# Altium project RP2040_Evaluation.PrjPcb
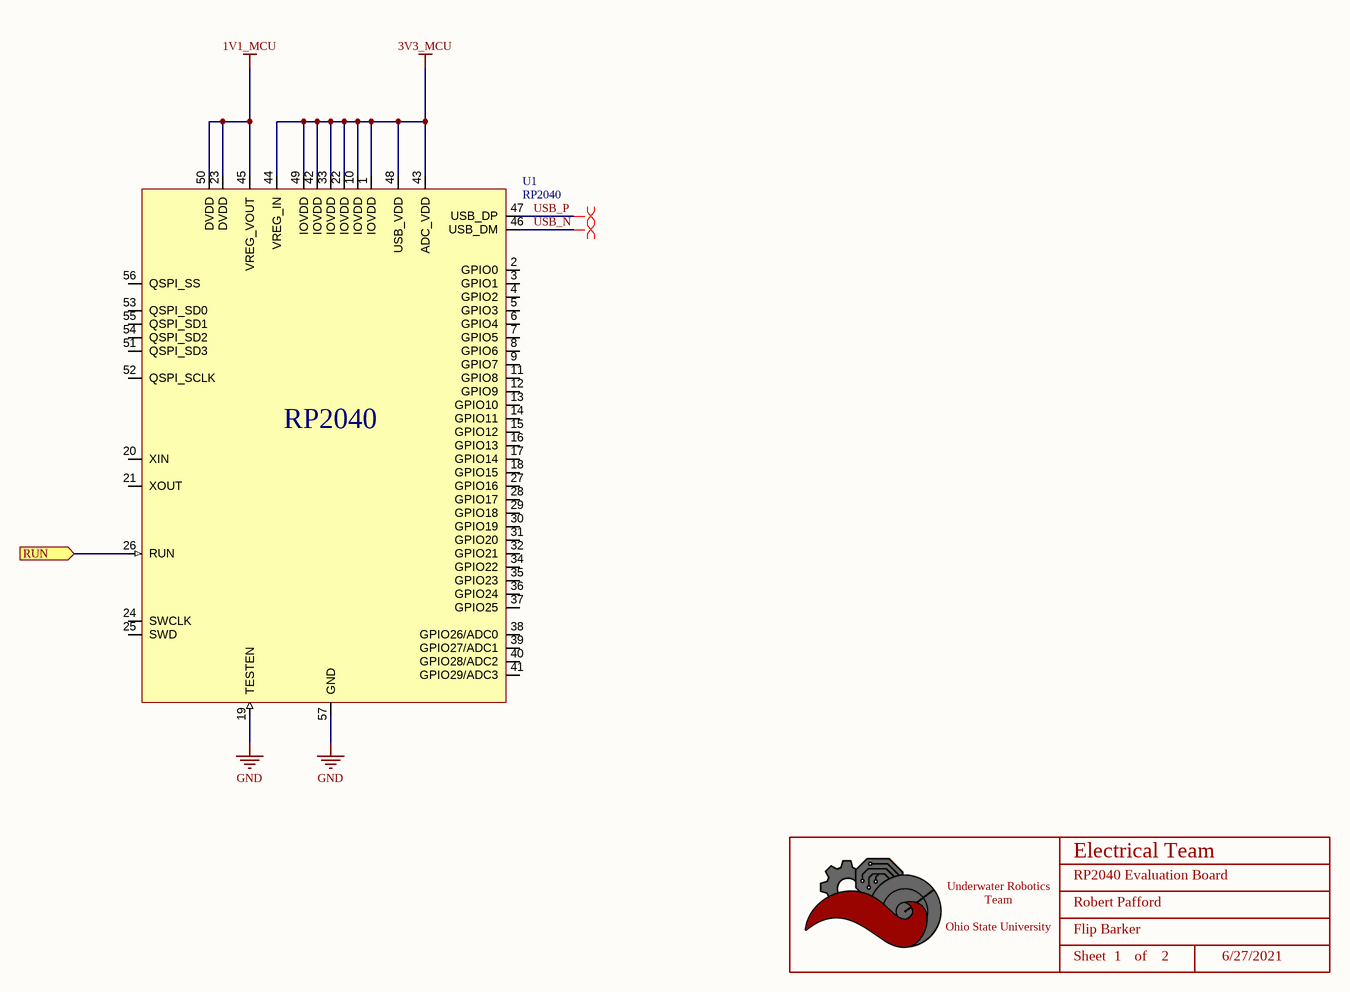
[diagram p0: RP2040_Evaluation_Design.SchDoc]
Project: RP2040 Evaluation; TeamLead: Flip Barker
1 sheet, 2 parts. Net scope: flat (ports and power ports of the same name join across sheets).
Board file: RP2040_Evaluation.PcbDoc

## Sheet RP2040_Evaluation_Design.SchDoc: RP2040 Evaluation Board
size B; Date: 6/27/2021; Author: Robert Pafford; Organization: ORGANIZATION; Address1: ADDRESS 1; Address2: ADDRESS 2; Address3: ADDRESS 3; Address4: ADDRESS 4; Revision: -; SheetNumber: 1; SheetTotal: 2; ENG_APP_DATE: --/--/--; DSN_APP_DATE: --/--/--; CHK_APP_DATE: --/--/--

### Parts
*  Title_Block  (value not drawn)  (graphical)
U1  RP2040  [QFN-56 RP2040]

### Ports
RUN (in)

### Nets
1V1_MCU: U1.23(DVDD) U1.45(VREG_VOUT) U1.50(DVDD)
3V3_MCU: U1.1(IOVDD) U1.10(IOVDD) U1.22(IOVDD) U1.33(IOVDD) U1.42(IOVDD) U1.43(ADC_VDD) U1.44(VREG_IN) U1.48(USB_VDD) U1.49(IOVDD)
GND: U1.19(TESTEN) U1.57(GND)
USB_N: U1.46(USB_DM)
USB_P: U1.47(USB_DP)
NetU1_26: U1.26(RUN) ; port RUN

Not connected (* = marked no-connect by the designer): U1 2(GPIO0) 3(GPIO1) 4(GPIO2) 5(GPIO3) 6(GPIO4) 7(GPIO5) 8(GPIO6) 9(GPIO7) 11(GPIO8) 12(GPIO9) 13(GPIO10) 14(GPIO11) 15(GPIO12) 16(GPIO13) 17(GPIO14) 18(GPIO15) 20(XIN) 21(XOUT) 24(SWCLK) 25(SWD) 27(GPIO16) 28(GPIO17) 29(GPIO18) 30(GPIO19) 31(GPIO20) 32(GPIO21) 34(GPIO22) 35(GPIO23) 36(GPIO24) 37(GPIO25) 38(GPIO26/ADC0) 39(GPIO27/ADC1) 40(GPIO28/ADC2) 41(GPIO29/ADC3) 51(QSPI_SD3) 52(QSPI_SCLK) 53(QSPI_SD0) 54(QSPI_SD2) 55(QSPI_SD1) 56(QSPI_SS)

### Layout directives
differential pair; differential pair class USB 2.0: USB_N, USB_P

### Notes on the sheet
- DWG. NO.
- REV.
- SHT.
- THIS DOCUMENT AND THE DATA DISCLOSED HEREIN OR HEREWITH IS THE PROPERTY OF ALTIUM LIMITED AND MAY BE FREELY DISTRIBUTED IN WHOLE. NO RIGHTS ARE RESERVED OR EXPRESS OR IMPLIED WARANTEE GIVEN.
- REVISION
- DESCRIPTION
- DATE
- APPROVED
- ENG:
- APPROVALS
- PROJECT
- DSN:
- CHK:
- REFERENCE DOCUMENTS
- PROJECT REVISION:
- TITLE
- DOCUMENT REVISION:
- DESIGN ITEM:
- BOM:
- FAB DWG:
- PCB DWG:
- ASSY DWG:
- SCALE:
- SIZE
- B
- CAGE CODE
- FILE NAME
- DWG NO.
- SHEET
- OF
- REV
- (in symbol Title_Block) Electrical Team; Underwater Robotics Team / Ohio State University; Sheet; of

### Library data of the parts
* = Title_Block: UWRT Schematic Title Block Template / Created June 2021, Dylan Trainor
U1 = RP2040: Raspberry Pi RP2040; ComponentLink1Description: DigiKey; ComponentLink1URL: *